# EAGLE design main (EAGLE 9.2.2)
TITLE: Micromouse PCB Design
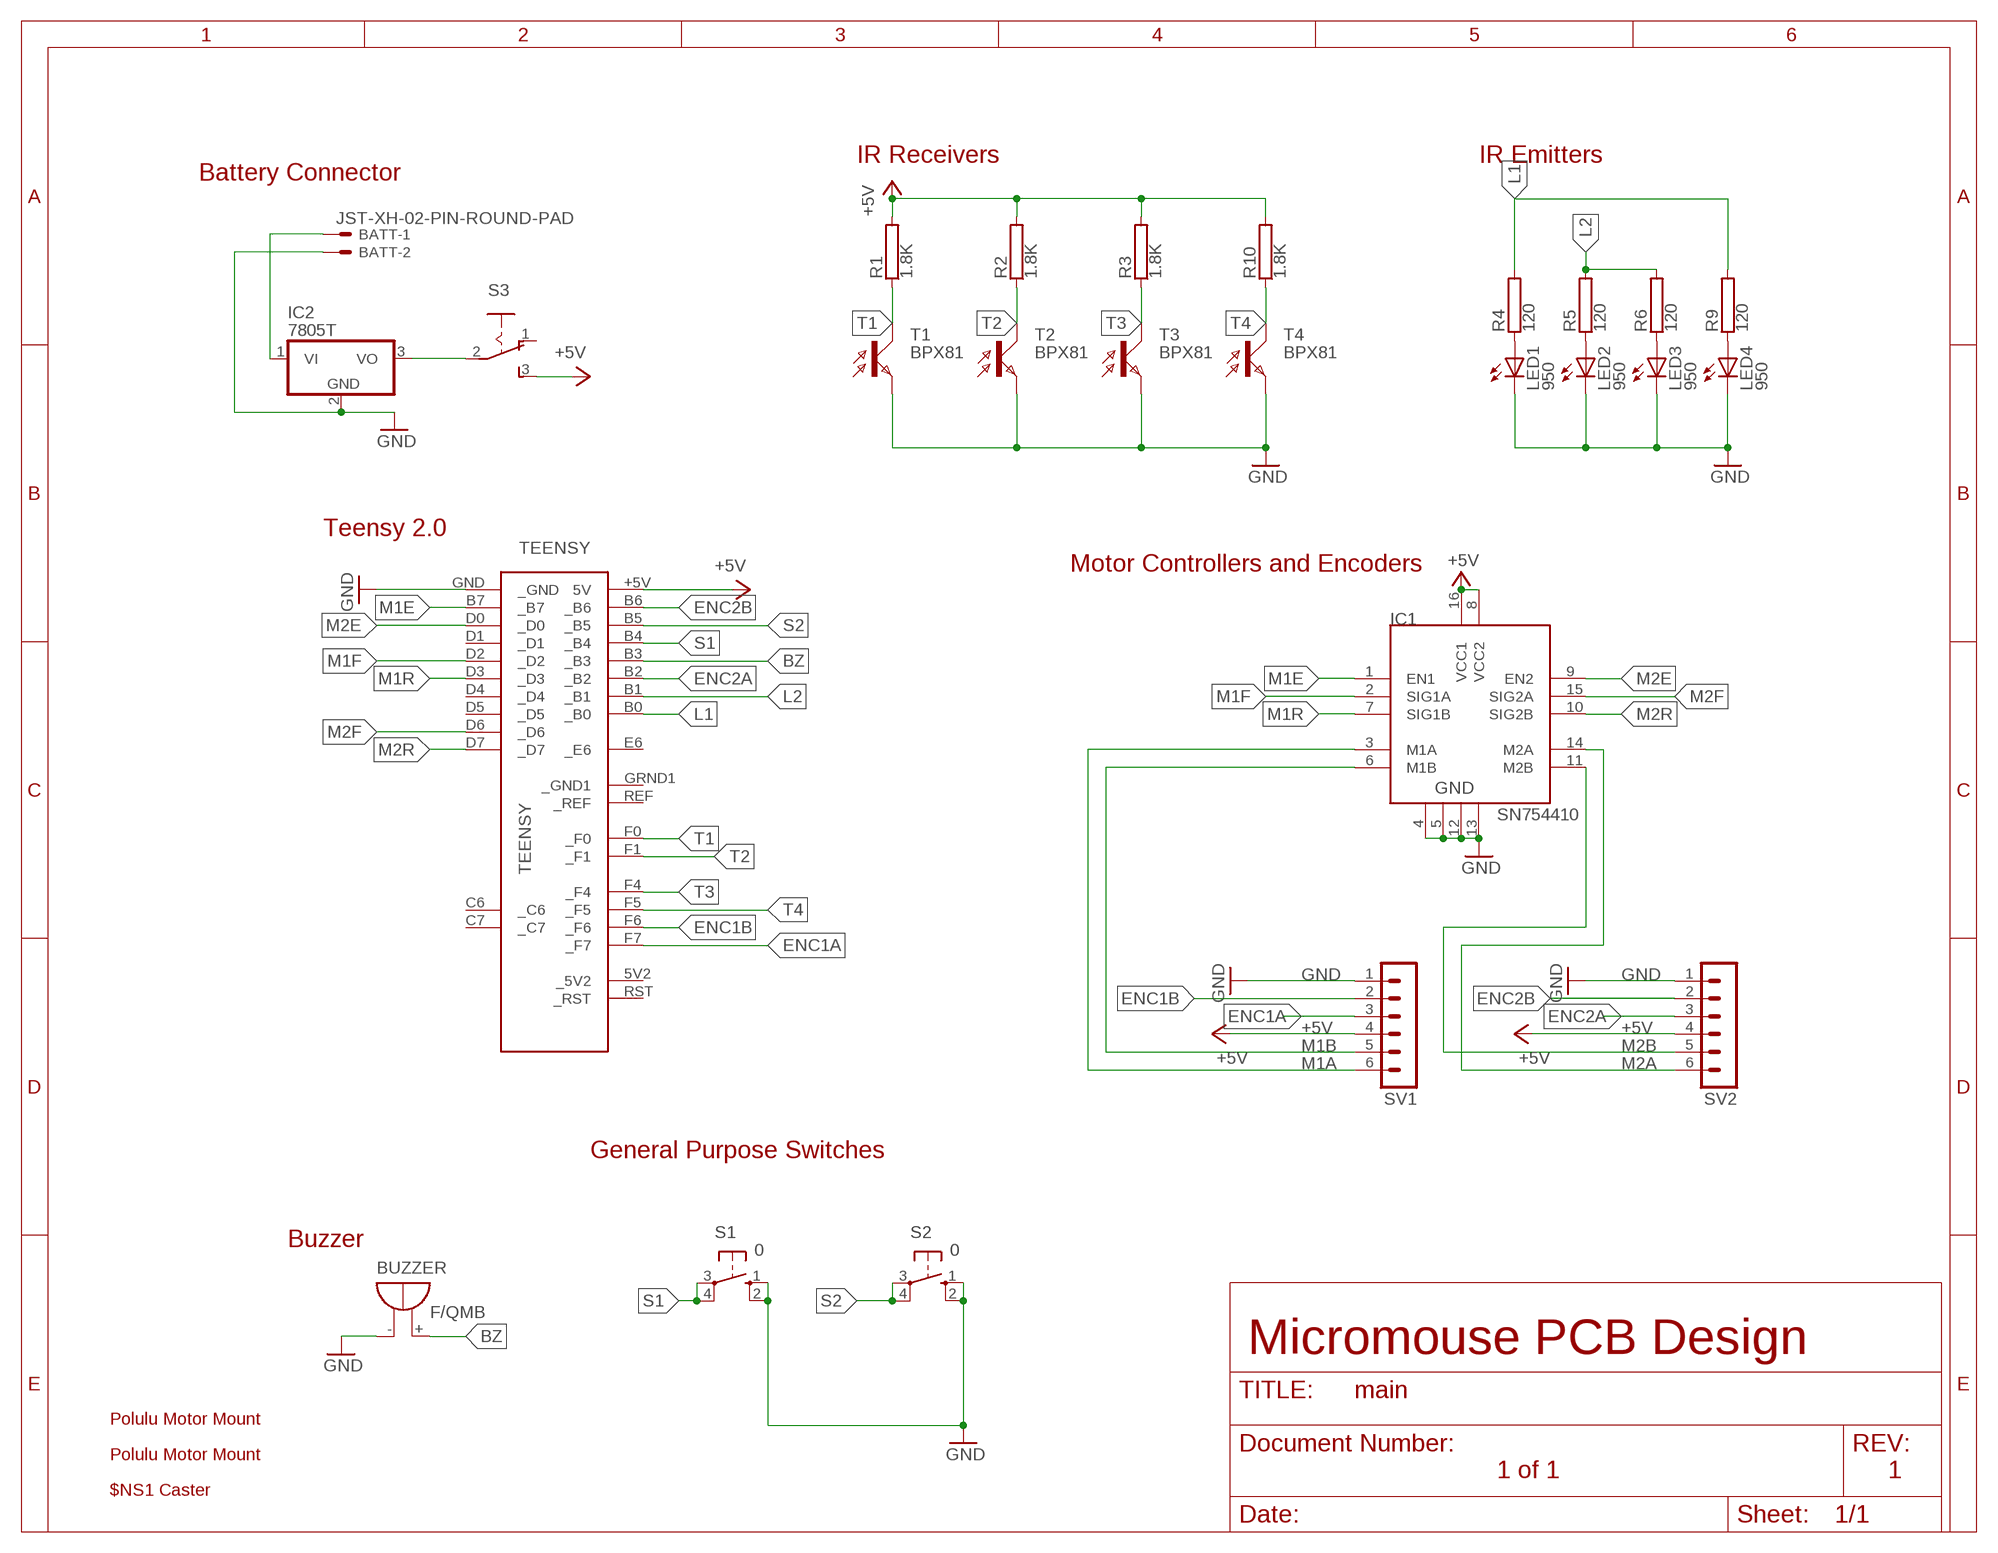
[diagram p0: schematic, sheet 1]

## Parts
BATT  JST-XH-02-PIN-ROUND-PAD  [JST-XH-02-PACKAGE-ROUND-PAD]
BUZZER  F/QMB  [F/QMB]
IC1  SN754410  [DIP16]
IC2  7805T  [TO220H]
LED1  950  LED3MM  [LED3MM]
LED2  950  LED3MM  [LED3MM]
LED3  950  LED3MM  [LED3MM]
LED4  950  LED3MM  [LED3MM]
R1  1.8K  RRS1/4  [RS1/4]
R2  1.8K  RRS1/4  [RS1/4]
R3  1.8K  RRS1/4  [RS1/4]
R4  120  RRS1/4  [RS1/4]
R5  120  RRS1/4  [RS1/4]
R6  120  RRS1/4  [RS1/4]
R9  120  RRS1/4  [RS1/4]
R10  1.8K  RRS1/4  [RS1/4]
S1  0  10-XX  [B3F-10XX]
S2  0  10-XX  [B3F-10XX]
S3  255SB  [255SB]
SV1  MA06-1  [MA06-1]
SV2  MA06-1  [MA06-1]
T1  BPX81  [BPX81]
T2  BPX81  [BPX81]
T3  BPX81  [BPX81]
T4  BPX81  [BPX81]
TEENSY  TEENSY  [TEENSY]
U$1  POLULUMOTOR  [FP]
U$2  POLULUMOTOR  [FP]
U$3  CASTERBALL  [FB_CASTER]

## Nets
+5V: IC1.8(VCC2) IC1.16(VCC1) R1.2 R2.2 R3.2 R10.2 S3.3(S) SV1.4 SV2.4 TEENSY.+5V(5V)
BZ: BUZZER.+(-) TEENSY.B3(_B3)
ENC1A: SV1.3 TEENSY.F7(_F7)
ENC1B: SV1.2 TEENSY.F6(_F6)
ENC2A: SV2.3 TEENSY.B2(_B2)
ENC2B: SV2.2 TEENSY.B6(_B6)
GND: BATT.2 BUZZER.-(+) IC1.4 IC1.5 IC1.12 IC1.13 IC2.2(GND) LED1.K(C) LED2.K(C) LED3.K(C) LED4.K(C) S1.1(S) S1.2(S1) S2.1(S) S2.2(S1) SV1.1 SV2.1 T1.E T2.E T3.E T4.E TEENSY.GND(_GND)
L1: R4.2 R9.2 TEENSY.B0(_B0)
L2: R5.2 R6.2 TEENSY.B1(_B1)
M1A: IC1.3(M1A) SV1.6
M1B: IC1.6(M1B) SV1.5
M1E: IC1.1(EN1) TEENSY.B7(_B7)
M1F: IC1.2(SIG1A) TEENSY.D2(_D2)
M1R: IC1.7(SIG1B) TEENSY.D3(_D3)
M2A: IC1.14(M2A) SV2.6
M2B: IC1.11(M2B) SV2.5
M2E: IC1.9(EN2) TEENSY.D0(_D0)
M2F: IC1.15(SIG2A) TEENSY.D6(_D6)
M2R: IC1.10(SIG2B) TEENSY.D7(_D7)
N$1: LED1.A R4.1
N$6: LED2.A R5.1
N$7: LED3.A R6.1
N$8: BATT.1 IC2.1(VI)
N$9: LED4.A R9.1
N$10: IC2.3(VO) S3.2(P)
S1: S1.3(P) S1.4(P1) TEENSY.B4(_B4)
S2: S2.3(P) S2.4(P1) TEENSY.B5(_B5)
T1: R1.1 T1.C TEENSY.F0(_F0)
T2: R2.1 T2.C TEENSY.F1(_F1)
T3: R3.1 T3.C TEENSY.F4(_F4)
T4: R10.1 T4.C TEENSY.F5(_F5)
Unconnected: S3.1(O) TEENSY.5V2(_5V2) TEENSY.C6(_C6) TEENSY.C7(_C7) TEENSY.D1(_D1) TEENSY.D4(_D4) TEENSY.D5(_D5) TEENSY.E6(_E6) TEENSY.GRND1(_GND1) TEENSY.REF(_REF) TEENSY.RST(_RST)

## Notes on the sheet
- IR Receivers | IR Emitters
- Battery Connector
- Teensy 2.0
- Motor Controllers and Encoders
- General Purpose Switches
- Buzzer
- Micromouse PCB Design
- 1 of 1 | 1

## Library data of the parts
BATT = Rembrandt Electronics - JST XH Connectors v1-0:JST-XH-02-PIN: JST XH Connector 2 Pin Wire to board connector. Pitch: 2,54 mm, (0.100") Number of pins: 2 Created by Rembrandt Electronics www.rembrandtelectronics.com; OC_NEWARK: unknown
BUZZER = buzzer:F/QMB: BUZZER Source: Buerklin; OC_FARNELL: unknown; OC_NEWARK: unknown
IC1 = HBridge:SN754410: Quadruple half-H driver; MF: TEXAS INSTRUMENTS; MPN: SN754410NE; OC_NEWARK: 08F8145
IC2 = linear:78*: Positive VOLTAGE REGULATOR Source: http://cache.national.com/ds/LM/LM78L05.pdf http://www.fairchildsemi.com/ds/LM/LM7805.pdf; MPN: NCP7805TG; OC_NEWARK: 81Y6957
LED1-LED4 = led:LED: LED OSRAM: - CHIPLED LG R971, LG N971, LY N971, LG Q971, LY Q971, LO R971, LY R971 LH N974, LH R974 LS Q976, LO Q976, LY Q976 LO Q996 - Hyper CHIPLED LW Q18S LB Q993, LB Q99A, LB R99A - SideLED LS A670, LO A670, LY A670, LG A670, LP A670 LB A673, LV A673, LT A673, LW A673 LH A674 LY A675 LS A676, LA A676, LO A676, LY A676, LW A676 LS A679, LY A679, LG A679 - Hyper Micro SIDELED® LS Y876, LA Y876, LO Y876, LY Y876 LT Y87S - SmartLED LW L88C, LW L88S LB L89C, LB L89S, LG L890 LS L89K, LO L89K, LY L89K LS L896, LA L896, LO L896, LY L896 - TOPLED LS T670, LO T670, LY T670, LG T670, LP T670 LSG T670, LSP T670, LSY T670, LOP T670, LYG T670 LG T671, LOG T671, LSG T671 LB T673, LV T673, LT T673, LW T673 LH T674 LS T676, LA T676, LO T676, LY T676, LB T676, LH T676, LSB T676, LW T676 LB T67C, LV T67C, LT T67C, LS T67K, LO T67K, LY T67K, LW E67C LS E67B, LA E67B, LO E67B, LY E67B, LB E67C, LV E67C, LT E67C LW T67C LS T679, LY T679, LG T679 LS T770, LO T770, LY T770, LG T770, LP T770 LB T773, LV T773, LT T773, LW T773 LH T774 LS E675, LA E675, LY E675, LS T675 LS T776, LA T776, LO T776, LY T776, LB T776 LHGB T686 LT T68C, LB T68C - Hyper Mini TOPLED® LB M676 - Mini TOPLED Santana® LG M470 LS M47K, LO M47K, LY M47K Source: http://www.osram.convergy.de LUXEON: - LUMILED® LXK2-PW12-R00, LXK2-PW12-S00, LXK2-PW14-U00, LXK2-PW14-V00 LXK2-PM12-R00, LXK2-PM12-S00, LXK2-PM14-U00 LXK2-PE12-Q00, LXK2-PE12-R00, LXK2-PE12-S00, LXK2-PE14-T00, LXK2-PE14-U00 LXK2-PB12-K00, LXK2-PB12-L00, LXK2-PB12-M00, LXK2-PB14-N00, LXK2-PB14-P00, LXK2-PB14-Q00 LXK2-PR12-L00, LXK2-PR12-M00, LXK2-PR14-Q00, LXK2-PR14-R00 LXK2-PD12-Q00, LXK2-PD12-R00, LXK2-PD12-S00 LXK2-PH12-R00, LXK2-PH12-S00 LXK2-PL12-P00, LXK2-PL12-Q00, LXK2-PL12-R00 Source: www.luxeon.com KINGBRIGHT: KA-3528ASYC Source: www.kingbright.com; MPN: CNX_B_E_4_1_04; OC_NEWARK: 08N2895
R1-R6 R9 R10 = resistor-power:R: Power Resitor; MF: OHMITE; MPN: RRS1K0; OC_FARNELL: unknown; OC_NEWARK: 01F7661
S1 S2 = switch-omron:10-XX: OMRON SWITCH; MPN: B3F-1000; OC_FARNELL: 176432; OC_NEWARK: unknown
S3 = switch:255SB: SLIDING SWITCH Distributor Buerklin, 11G810
SV1 SV2 = con-lstb:MA06-1: PIN HEADER; OC_FARNELL: unknown; OC_NEWARK: unknown
T1-T4 = opto-trans-siemens:BPX81: PHOTO TRANSISTOR; OC_FARNELL: unknown; OC_NEWARK: unknown
TEENSY = teensy:TEENSY: Teensy 2.0
U$1 U$2 = personal:POLULUMOTOR: Polulu Motor Footprint (connections not shown)
U$3 = personal:CASTERBALL: caster ball polulu

## Board
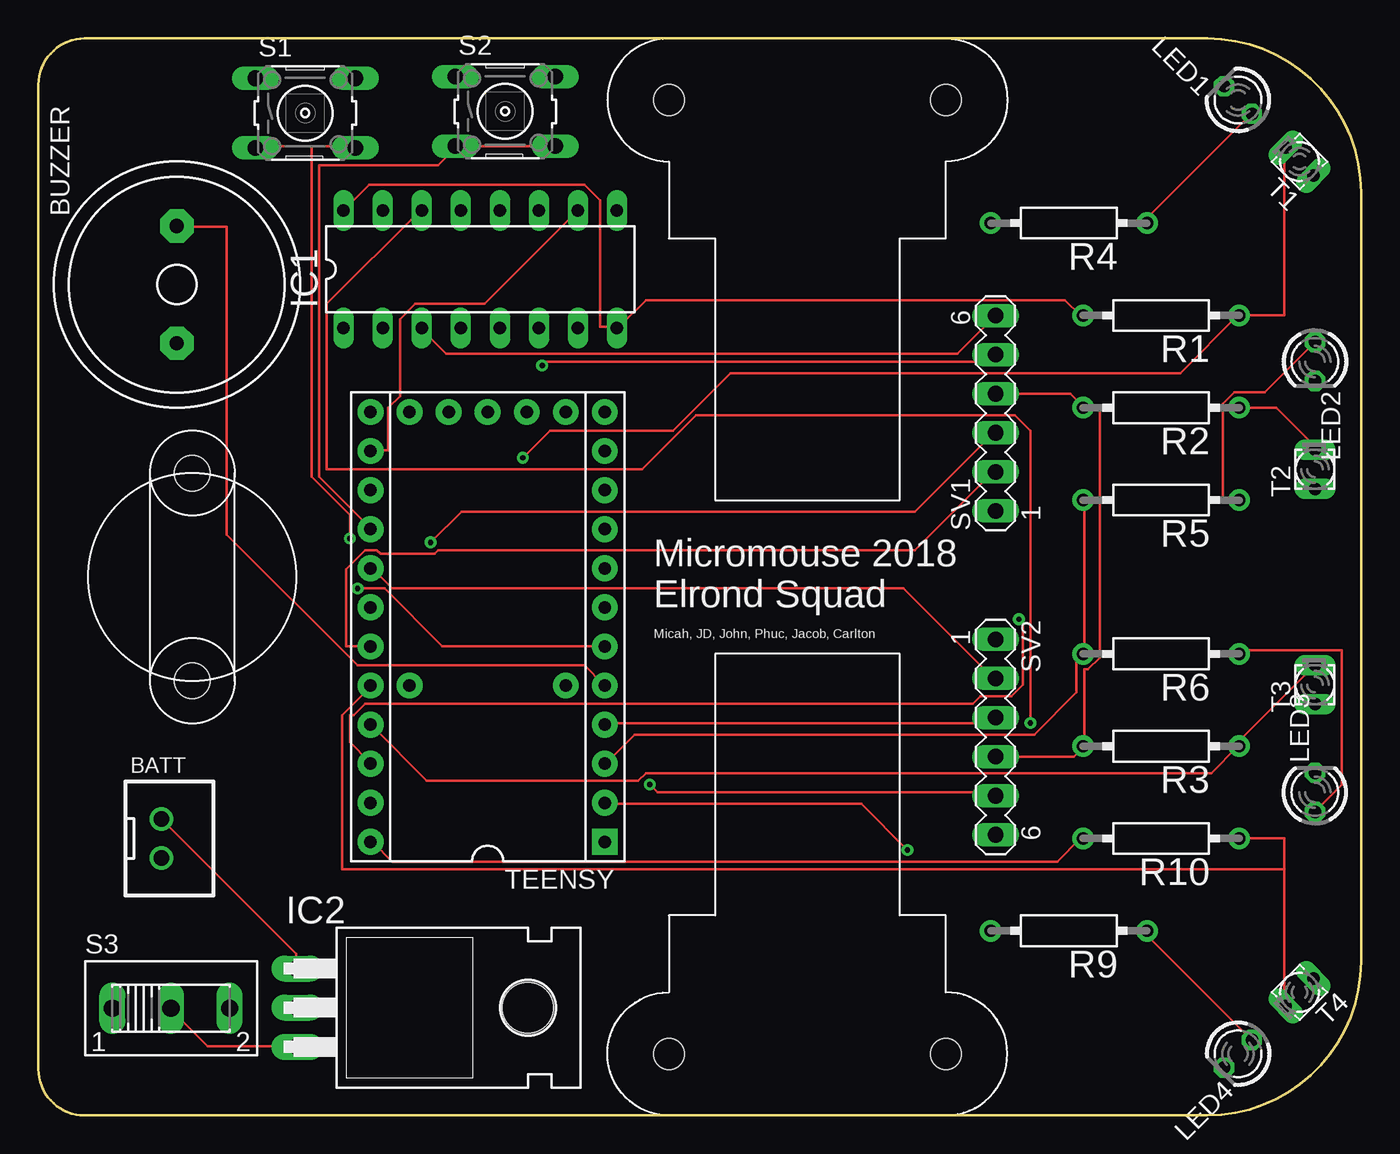
[diagram p1: board, top side]
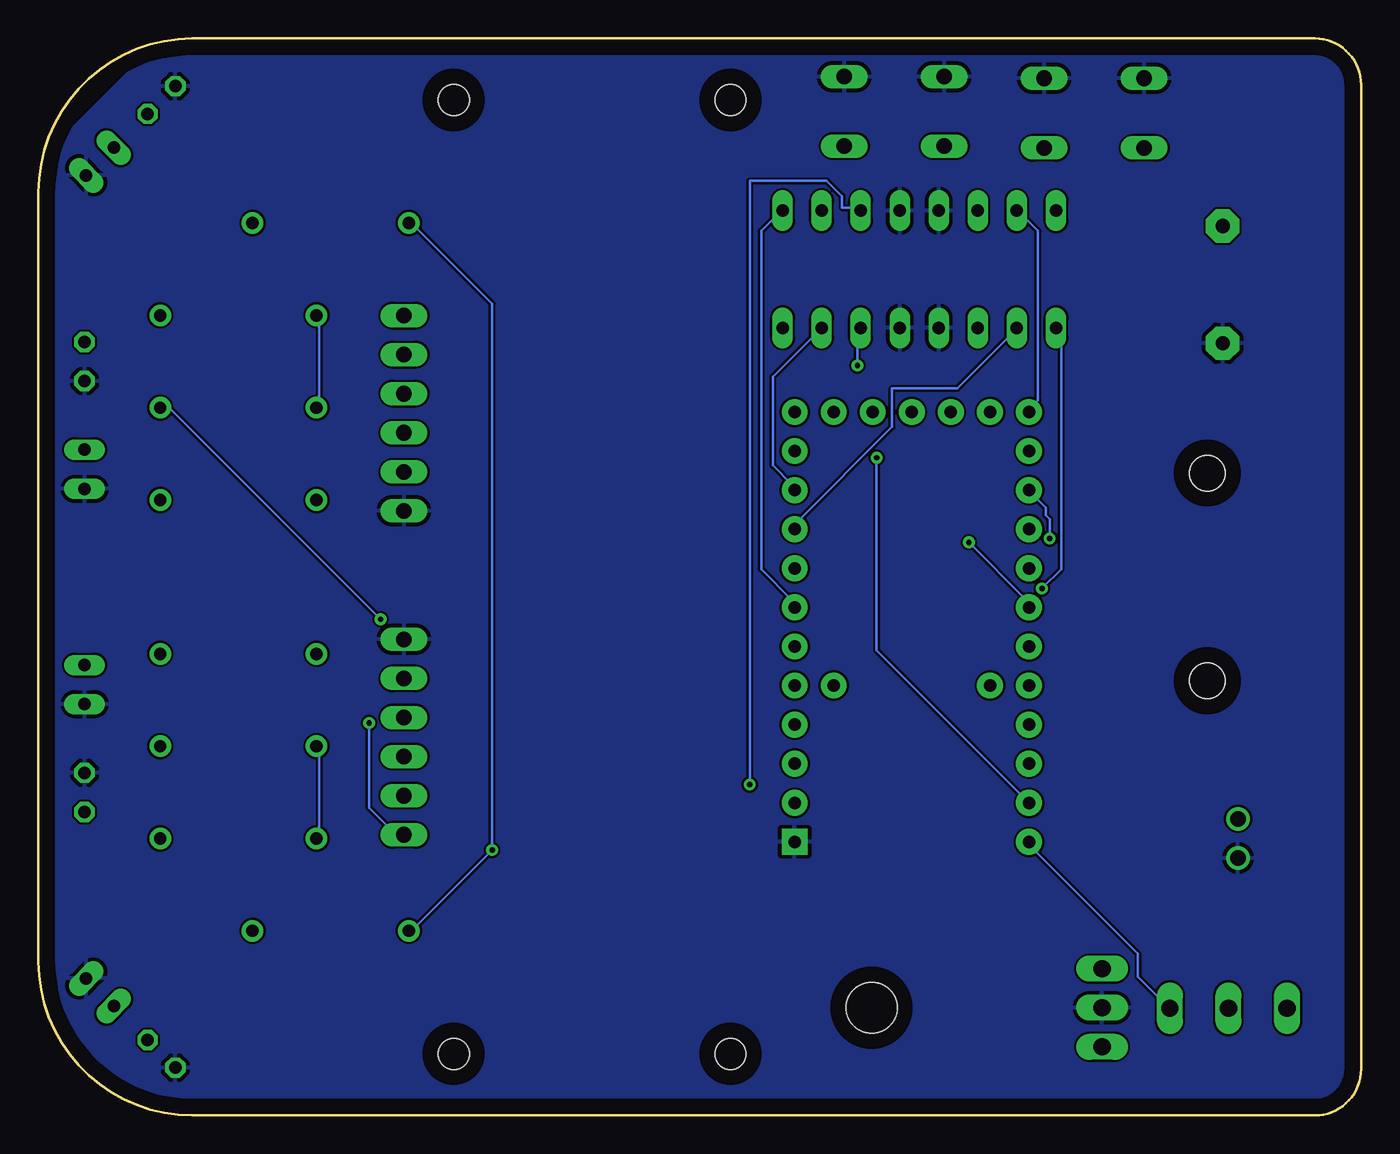
[diagram p2: board, bottom side, seen from below]

Size 86 x 70 mm. Coordinates in mm from the lower left corner, seen from the top.
Outline: 0,67 0,3 arc90 3,0 76,0 arc90 86,10 86,60 arc90 76,70 3,70 arc90 0,67
Copper layers (1*16): Top 0.035mm / dielectric 1.5mm / Bottom 0.035mm
Design rules "default": minimum track width 6mil, minimum drill 0.35mm, track to track 6mil, track to pad 6mil, pad to pad 6mil, via to via 6mil, smd to smd 6mil, copper to edge 40mil, drill to drill 6mil, minimum pad ring 10mil, minimum via ring 8mil, stop-mask expansion 4mil, vias tented up to drill 0mil, thermal gap 10mil

### Footprints (pad centres in the part's own frame; a part is rotated, then mirrored left to right if it is on the bottom)
JST-XH-02-PACKAGE-ROUND-PAD = drill 1.016: 1 -1.27,0; 2 1.27,0
F/QMB = drill 0.914 pad 2.159 octagon: + 3.81,0; - -3.81,0
DIP16 = drill 0.813 long: 1 -10.16,-3.81; 2 -7.62,-3.81; 3 -5.08,-3.81; 4 -2.54,-3.81; 5 0,-3.81; 6 2.54,-3.81; 7 5.08,-3.81; 8 7.62,-3.81; 9 7.62,3.81; 10 5.08,3.81; 11 2.54,3.81; 12 0,3.81; 13 -2.54,3.81; 14 -5.08,3.81; 15 -7.62,3.81; 16 -10.16,3.81
TO220H = drill 1.118 long: 1 -2.54,-10.16; 2 0,-10.16; 3 2.54,-10.16 | hole 3.302: 0,4.826
LED3MM = drill 0.813 octagon: A -1.27,0; K 1.27,0
RS1/4 = drill 0.8 pad 1.4: 1 -5.08,0; 2 5.08,0
B3F-10XX = drill 1.016 long: 1 -3.251,2.261; 2 3.251,2.261; 3 -3.251,-2.261; 4 3.251,-2.261
255SB = drill 1.118 long: 1 -3.81,0; 2 0,0; 3 3.81,0
MA06-1 = drill 1.016 long: 1 -6.35,0; 2 -3.81,0; 3 -1.27,0; 4 1.27,0; 5 3.81,0; 6 6.35,0
BPX81 = drill 0.813 long: C 1.27,0; E -1.27,0
TEENSY = drill 0.813 pad 1.676: 5V2 13.97,-2.54; +5V -13.97,7.62; B0 -11.43,-7.62; B1 -8.89,-7.62; B2 -6.35,-7.62; B3 -3.81,-7.62; B4 8.89,7.62; B5 6.35,7.62; B6 3.81,7.62; B7 -1.27,-7.62; C6 11.43,-7.62; C7 13.97,-7.62; D0 1.27,-7.62; D1 3.81,-7.62; D2 6.35,-7.62; D3 8.89,-7.62; D4 13.97,5.08; D5 13.97,-5.08; D6 13.97,7.62; D7 11.43,7.62; E6 -3.81,-5.08; F0 -11.43,7.62; F1 -8.89,7.62; F4 -6.35,7.62; F5 -3.81,7.62; F6 -1.27,7.62; F7 1.27,7.62; GRND1 13.97,0; REF -3.81,5.08; RST 13.97,2.54 | drill 0.813 pad 1.676 square: GND -13.97,-7.62
FP = hole 2: -4,9; -4,-9
FB_CASTER = hole 2.3: 6.75,0; -6.75,0

### Placement (x,y rotation side)
BATT  8,18 270 top
BUZZER  9,54 90 top
IC1  30,55 0 top
IC2  27,7 270 top
LED1  78,66 135 top
LED2  83,49 270 top
LED3  83,21 90 top
LED4  78,4 225 top
R1  73,52 180 top
R2  73,46 180 top
R3  73,24 180 top
R4  67,58 180 top
R5  73,40 180 top
R6  73,30 180 top
R9  67,12 180 top
R10  73,18 180 top
S1  17.35,65.15 0 top
S2  30.35,65.26 0 top
S3  8.62,6.97 0 top
SV1  62.23,45.64 90 top
SV2  62.23,24.59 270 top
T1  82,62 135 top
T2  83,42 90 top
T3  83,28 90 top
T4  82,8 225 top
TEENSY  29.21,31.75 90 top
U$1  50,0 270 top
U$2  50,70 90 top
U$3  10,35 90 top

### Tracks (layer width: path | path; a pad name or v marks a point on that pad's centre or on a via)
+5V
  Top 0.152: IC1.16 20,59 21.5,60.5 35.5,60.5 36.5,59.5 36.5,51.25 37.5,51.25 IC1.8 37.75,51.25 39.5,53 66.75,53 67.75,52 R1.2 | 68,24 68,29 68.25,29 69,29.75 69,46 68,46 | R2.2 68,46 | 68,24 R3.2 | TEENSY.+5V 21.75,17.75 23,16.5 66.25,16.5 67.75,18 R10.2 | SV1.4 67.09,46.91 68,46 | SV2.4 67.32,23.32 68,24
  Bottom 0.152: S3.3 12.5,7 14.5,9 14.5,10.5 21.5,17.5 21.5,17.75 TEENSY.+5V | R10.2 67.75,18 67.75,24 R3.2 | R2.2 67.75,46 67.75,52 R1.2
BZ
  Top 0.152: TEENSY.B3 36.75,28 35.5,29.25 20.75,29.25 12.25,37.75 12.25,57.75 9,57.75 BUZZER.+
ENC1A  (via drill 0.35)
  Top 0.152: v25.5,37.25 27.5,39.25 57,39.25 62,44.25 SV1.3
  Bottom 0.152: v25.5,37.25 21.75,33.5 21.75,33.25 TEENSY.F7
ENC1B
  Top 0.152: SV1.2 62,41.75 57,36.75 26,36.75 25.75,36.5 22.25,36.5 22,36.75 21.25,36.75 20,35.5 20,30.5 21.5,30.5 TEENSY.F6
ENC2A
  Top 0.152: SV2.3 62,25.75 61.75,25.5 37,25.5 TEENSY.B2
ENC2B
  Top 0.152: SV2.2 62,28.5 56.25,34.25 23,34.25 21.75,35.5 TEENSY.B6
GND
  pour Bottom: 0,70 78,70 86,62 86,9 86,6 80,0 0,0
L1  (via drill 0.35)
  Top 0.152: v56.5,17.25 53.5,20.25 37,20.25 TEENSY.B0
  Bottom 0.152: R9.2 61.75,12 v56.5,17.25 56.5,52.75 61.75,58 R4.2
L2
  Top 0.152: R5.2 68,40 68,30 R6.2 67.5,30 67.5,27.5 64.75,24.75 38.75,24.75 37,23 TEENSY.B1
M1A
  Top 0.152: IC1.3 25,51 26.5,49.5 59.75,49.5 62,51.75 SV1.6
M1B  (via drill 0.35)
  Top 0.152: v32.75,48.75 33,49 61.75,49 62,49.25 SV1.5
  Bottom 0.152: v32.75,48.75 32.75,51 IC1.6
M1E  (via drill 0.35)
  Top 0.152: v20.75,34.25 22.5,34.25 26.25,30.5 36.75,30.5 TEENSY.B7
  Bottom 0.152: v20.75,34.25 19.5,35.5 19.5,50.75 19.75,51 IC1.1
M1F
  Bottom 0.152: IC1.2 22.5,51 26.25,47.25 30.5,47.25 30.5,44.75 36.75,38.5 36.75,38.25 TEENSY.D2
M1R
  Bottom 0.152: IC1.7 35.25,51 38.25,48 38.25,42.25 37,41 37,40.75 TEENSY.D3
M2A  (via drill 0.35)
  Top 0.152: v64.5,25.5 64.5,44.5 63.5,45.5 42.75,45.5 39.25,42 18.75,42 18.75,52.75 24.75,58.75 IC1.14
  Bottom 0.152: v64.5,25.5 64.5,20 62.75,18.25 62.25,18.25 SV2.6
M2B  (via drill 0.35)
  Top 0.152: v39.75,21.5 40.25,21 62,21 SV2.5
  Bottom 0.152: v39.75,21.5 39.75,60.75 34.75,60.75 33.75,59.75 33.75,59 32.75,59 IC1.11
M2E
  Bottom 0.152: IC1.9 37.75,58.75 39,57.5 39,35.5 37,33.5 37,33.25 TEENSY.D0
M2F
  Bottom 0.152: IC1.15 22.25,58.75 21,57.5 21,46.5 21.5,46 21.5,45.75 TEENSY.D6
M2R
  Top 0.152: IC1.10 35,58.75 29,52.75 24.5,52.75 23.5,51.75 23.5,46.75 22.75,46 22.75,43.25 21.75,43.25 TEENSY.D7
N$1
  Top 0.152: LED1.A 78.75,65 72.25,58.5 72.25,58 R4.1
N$6
  Top 0.152: R5.1 77,40 77,46.25 77.75,47 79.75,47 83,50.25 LED2.A
N$7
  Top 0.152: LED3.A 83,19.75 84.75,21.5 84.75,30.25 78.5,30.25 78.25,30 R6.1
N$8
  Top 0.152: BATT.1 8,19.25 16.75,10.5 16.75,9.75 IC2.1
N$9
  Top 0.152: LED4.A 78.75,5 72.25,11.5 72.25,12 R9.1
N$10
  Top 0.152: S3.2 8.75,6.75 11,4.5 16.75,4.5 IC2.3
S1  (via drill 0.35)
  Top 0.152: 17.75,63 20.5,63 S1.4 | 17.75,63 14.25,63 S1.3 | v20.25,37.5 20.25,39 17.75,41.5 17.75,63
  Bottom 0.152: v20.25,37.5 20.25,38.75 20.5,39 20.5,39.5 21.5,40.5 TEENSY.B4
S2
  Top 0.152: S2.4 33.5,63 27.25,63 S2.3 27,62.75 26,61.75 18.25,61.75 18.25,41.5 21.5,38.25 TEENSY.B5
T1  (via drill 0.35)
  Top 0.152: T1.C 81,62.75 81,52 R1.1 78,52 74.25,48.25 45,48.25 41.25,44.5 33.25,44.5 v31.5,42.75
  Bottom 0.152: v31.5,42.75 31.5,30.25 21.75,20.5 TEENSY.F0
T2  (via drill 0.35)
  Top 0.152: R2.1 80.5,46 83,43.5 T2.C | v63.75,32.25 64,32.25 64,28 63.25,27.25 61.25,27.25 60.75,26.75 21.25,26.75 20.5,26 20.25,26 20.25,24.25 21.5,23 TEENSY.F1
  Bottom 0.152: v63.75,32.25 77.5,46 R2.1
T3
  Top 0.152: T3.C 83,29.25 78.25,24.5 78.25,24 R3.1 78,24 76.25,22.25 39.5,22.25 39,21.75 25.25,21.75 21.75,25.25 TEENSY.F4
T4
  Top 0.152: 81,16 81,18 R10.1 | 81,16 81,7.25 T4.C | 81,16 19.75,16 19.75,26 21.5,27.75 TEENSY.F5

### Text on the board
tNames: Micromouse 2018 / Elrond Squad | Micah, JD, John, Phuc, Jacob, Carlton